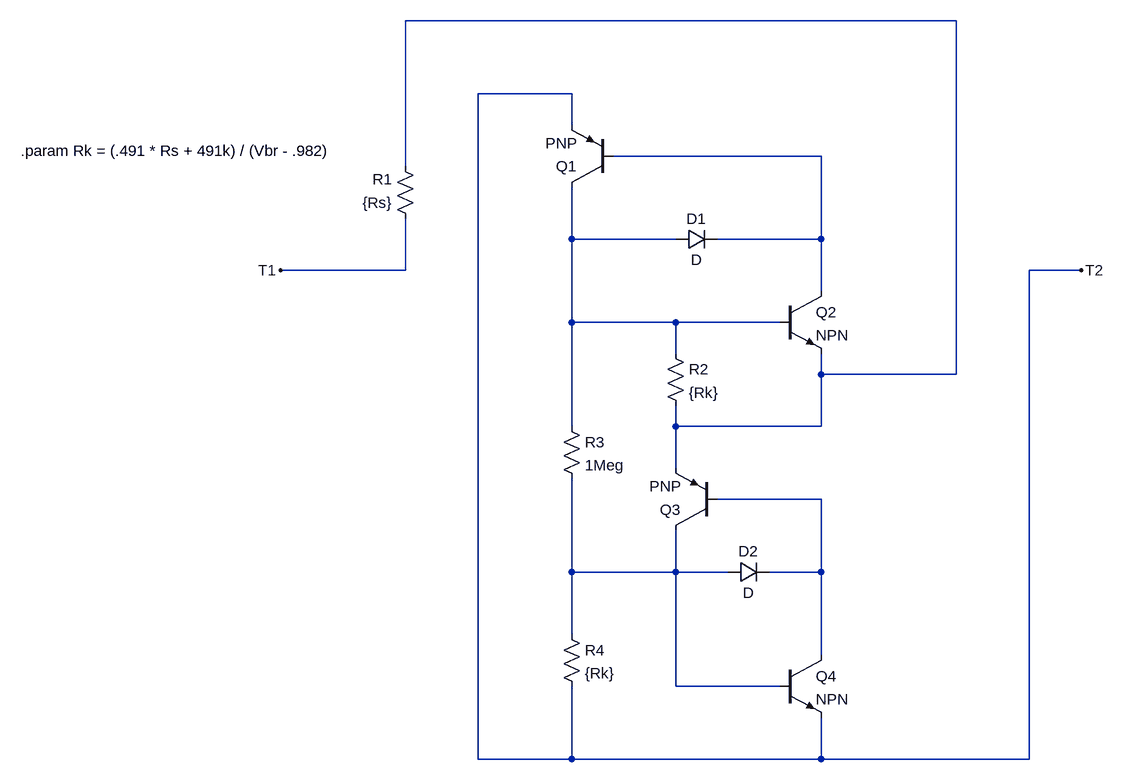
[diagram p0: schematic Diac.asc]
Diac.asc, the LTspice schematic file:
Version 4
SHEET 1 1040 828
WIRE 800 -336 -48 -336
WIRE 208 -224 64 -224
WIRE 208 -176 208 -224
WIRE 592 -128 272 -128
WIRE -48 -112 -48 -336
WIRE 208 0 208 -80
WIRE 368 0 208 0
WIRE 592 0 592 -128
WIRE 592 0 432 0
WIRE -48 48 -48 -32
WIRE -48 48 -240 48
WIRE 992 48 912 48
WIRE 592 80 592 0
WIRE 208 128 208 0
WIRE 368 128 208 128
WIRE 528 128 368 128
WIRE 368 176 368 128
WIRE 592 208 592 176
WIRE 800 208 800 -336
WIRE 800 208 592 208
WIRE 208 288 208 128
WIRE 368 288 368 256
WIRE 592 288 592 208
WIRE 592 288 368 288
WIRE 368 352 368 288
WIRE 592 400 432 400
WIRE 208 512 208 368
WIRE 368 512 368 448
WIRE 368 512 208 512
WIRE 448 512 368 512
WIRE 592 512 592 400
WIRE 592 512 512 512
WIRE 208 608 208 512
WIRE 592 640 592 512
WIRE 368 688 368 512
WIRE 528 688 368 688
WIRE 64 800 64 -224
WIRE 208 800 208 688
WIRE 208 800 64 800
WIRE 592 800 592 736
WIRE 592 800 208 800
WIRE 912 800 912 48
WIRE 912 800 592 800
FLAG -240 48 T1
FLAG 992 48 T2
SYMBOL res -32 -16 R180
WINDOW 0 36 76 Left 0
WINDOW 3 36 40 Left 0
SYMATTR InstName R1
SYMATTR Value {Rs}
SYMBOL pnp 272 -80 R180
SYMATTR InstName Q1
SYMBOL npn 528 80 R0
SYMATTR InstName Q2
SYMBOL diode 368 16 R270
WINDOW 0 32 32 VTop 0
WINDOW 3 0 32 VBottom 0
SYMATTR InstName D1
SYMBOL res 352 160 R0
SYMATTR InstName R2
SYMATTR Value {Rk}
SYMBOL pnp 432 448 R180
SYMATTR InstName Q3
SYMBOL diode 448 528 R270
WINDOW 0 32 32 VTop 0
WINDOW 3 0 32 VBottom 0
SYMATTR InstName D2
SYMBOL npn 528 640 R0
SYMATTR InstName Q4
SYMBOL res 192 272 R0
SYMATTR InstName R3
SYMATTR Value 1Meg
SYMBOL res 192 592 R0
SYMATTR InstName R4
SYMATTR Value {Rk}
TEXT -640 -136 Left 0 !.param Rk = (.491 * Rs + 491k) / (Vbr - .982)

The netlist it stands for:
* Diac.asc
R1 T1 N001 {Rs}
Q1 N003 N002 T2 0 PNP
Q2 N002 N003 N001 0 NPN
D1 N003 N002 D
R2 N003 N001 {Rk}
Q3 N005 N004 N001 0 PNP
D2 N005 N004 D
Q4 N004 N005 T2 0 NPN
R3 N003 N005 1Meg
R4 N005 T2 {Rk}
.model D D
.lib standard.dio
.model NPN NPN
.model PNP PNP
.lib standard.bjt
.param Rk = (.491 * Rs + 491k) / (Vbr - .982)
.backanno
.end